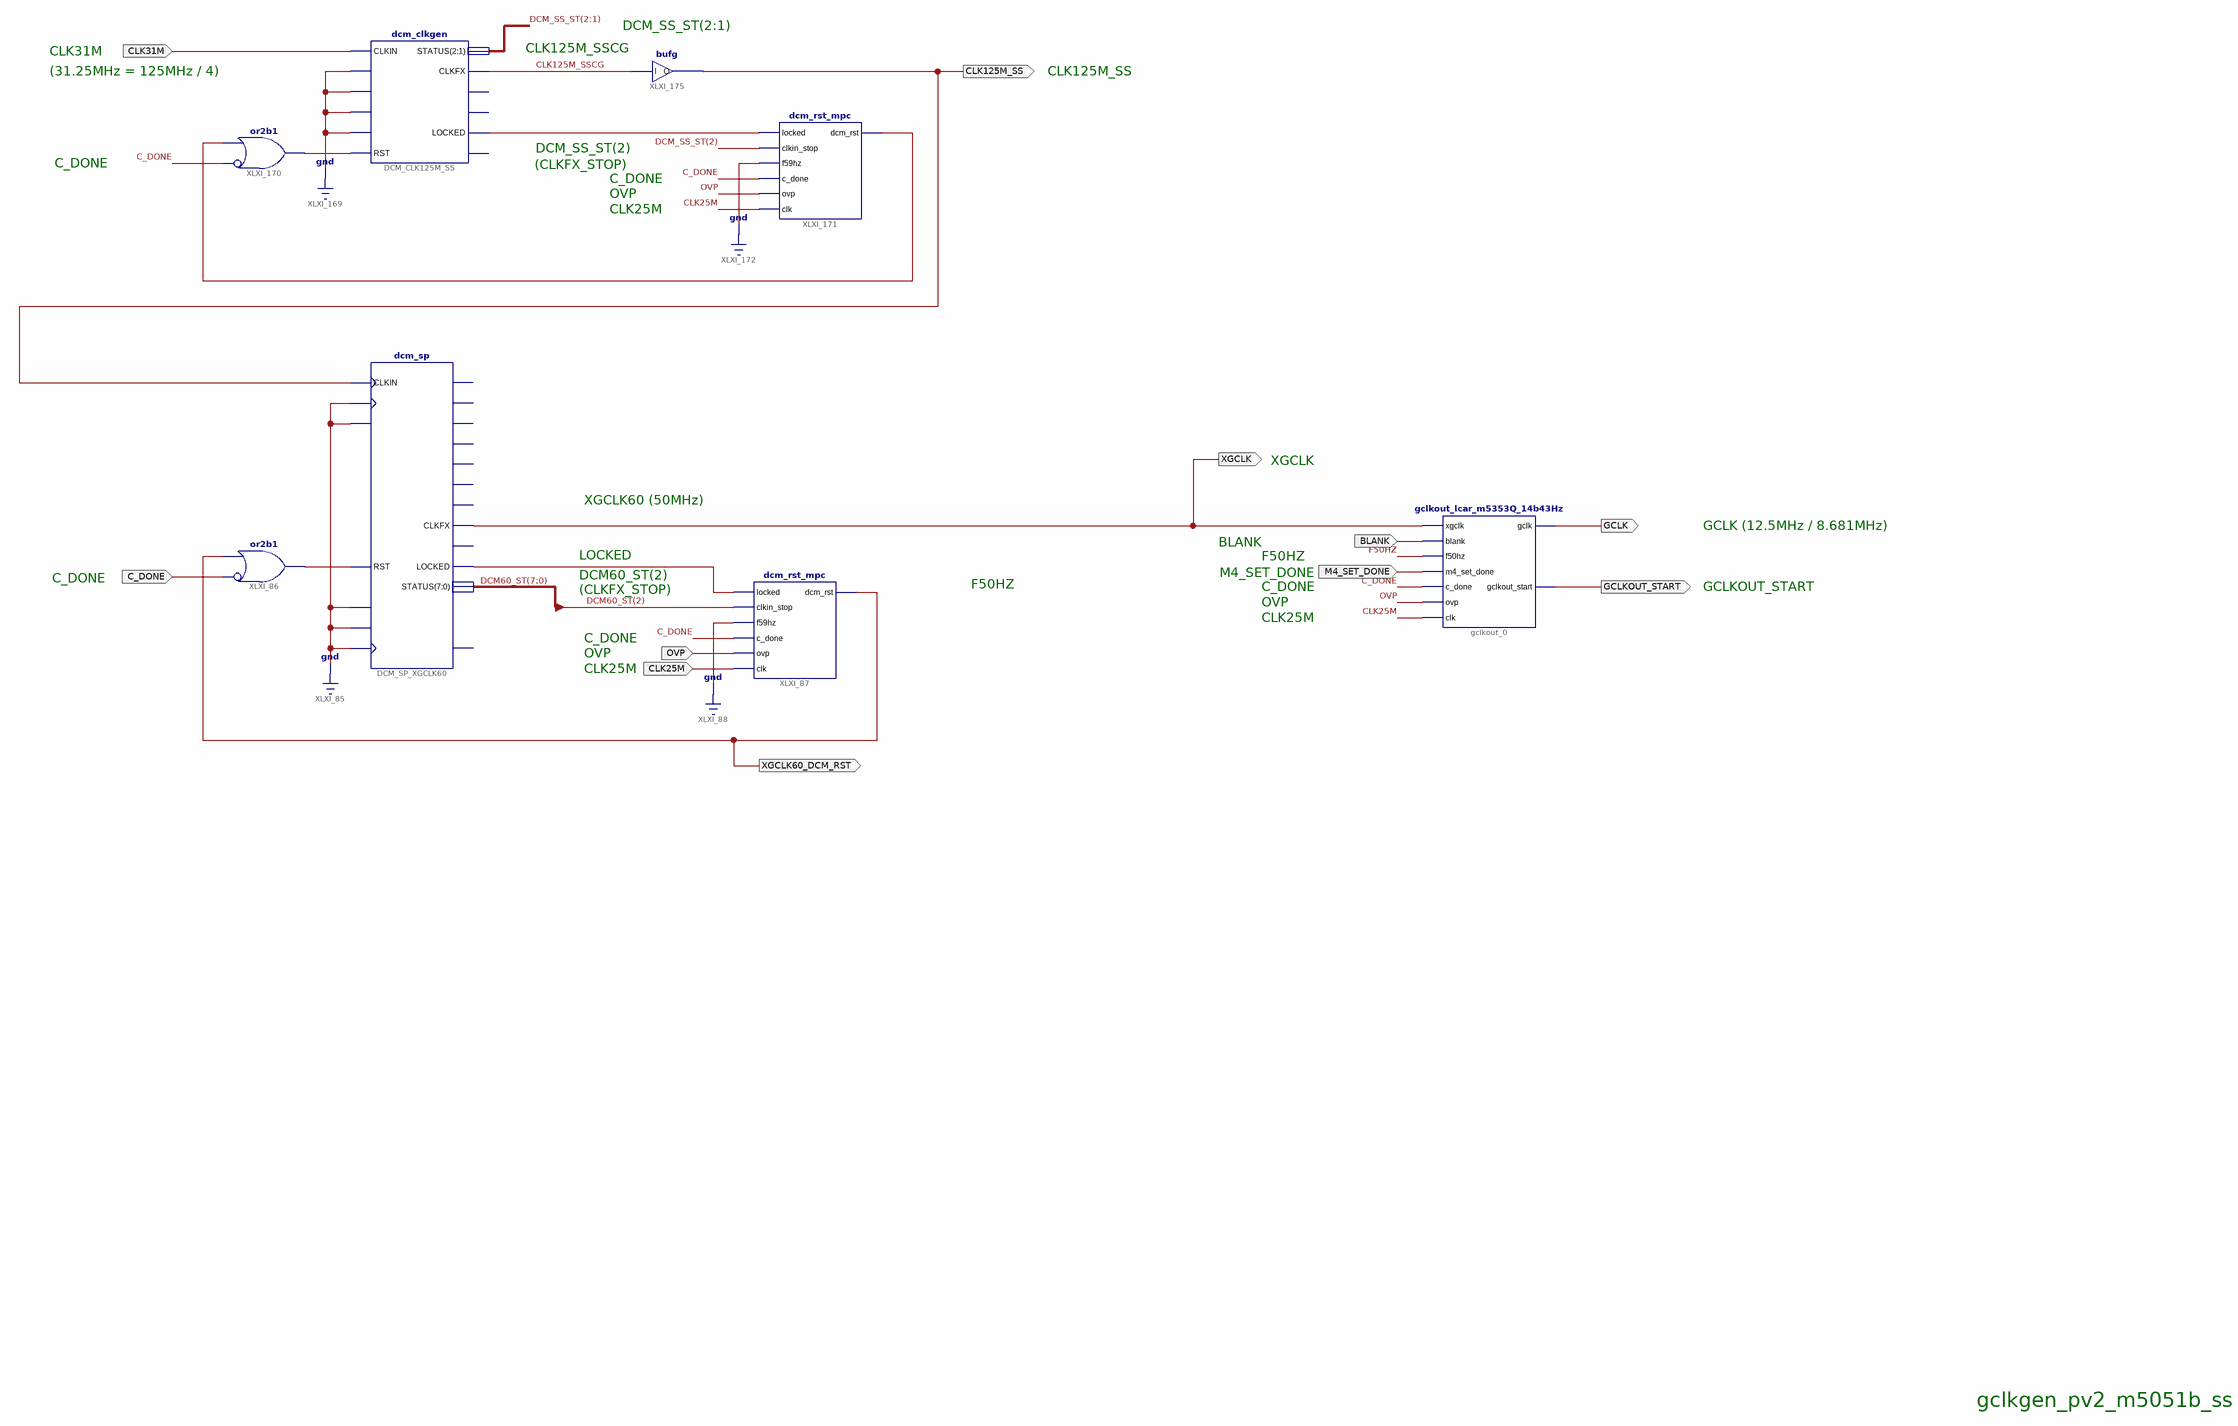
[diagram p0: schematic sheet 1]
// Xilinx ISE schematic gclkgen_lcar_m5353Q_14b43Hz.sch (aspartan6) as structural Verilog: 8 symbols, 11 ports
module gclkgen_lcar_m5353Q_14b43Hz (
  input  C_DONE,
  input  OVP,
  input  CLK25M,
  input  CLK31M,
  input  BLANK,
  input  M4_SET_DONE,
  output XGCLK60_DCM_RST,
  output XGCLK,
  output GCLK,
  output GCLKOUT_START,
  output CLK125M_SS
);

  wire CLK125M_SSCG, F50HZ, XLXN_151, XLXN_159, XLXN_355, XLXN_367, XLXN_368;
  wire [2:1] DCM_SS_ST;
  wire [7:0] DCM60_ST;

  dcm_sp #(.CLKIN_PERIOD(8), .CLK_FEEDBACK("NONE"), .CLKFX_MULTIPLY(4), .CLKFX_DIVIDE(10), .DESKEW_ADJUST("SYSTEM_SYNCHRONOUS")) DCM_SP_XGCLK60 (
    .CLKFB(1'b0), .CLKIN(CLK125M_SS), .DSSEN(1'b0), .PSCLK(1'b0), .PSEN(1'b0), .PSINCDEC(1'b0),
    .RST(XLXN_151), .CLKFX(XGCLK), .LOCKED(XLXN_159), .STATUS(DCM60_ST));  // open: CLK0, CLK180, CLK270, CLK2X, CLK2X180, CLK90, CLKDV, CLKFX180, PSDONE
  or XLXI_86 (XLXN_151, ~C_DONE, XGCLK60_DCM_RST);  // or2b1
  dcm_rst_mpc XLXI_87 (
    .locked(XLXN_159), .dcm_rst(XGCLK60_DCM_RST), .clkin_stop(DCM60_ST[2]), .f59hz(1'b0), .c_done(C_DONE),
    .ovp(OVP), .clk(CLK25M));
  dcm_clkgen #(.SPREAD_SPECTRUM("CENTER_HIGH_SPREAD"), .CLKIN_PERIOD(32.0), .CLKFX_MULTIPLY(8), .CLKFX_MD_MAX(4.000), .CLKFX_DIVIDE(2)) DCM_CLK125M_SS (
    .CLKIN(CLK31M), .FREEZEDCM(1'b0), .PROGCLK(1'b0), .PROGDATA(1'b0), .PROGEN(1'b0), .RST(XLXN_355),
    .STATUS(DCM_SS_ST), .CLKFX(CLK125M_SSCG), .LOCKED(XLXN_367));  // open: CLKFX180, CLKFXDV, PROGDONE
  or XLXI_170 (XLXN_355, ~C_DONE, XLXN_368);  // or2b1
  dcm_rst_mpc XLXI_171 (
    .locked(XLXN_367), .dcm_rst(XLXN_368), .clkin_stop(DCM_SS_ST[2]), .f59hz(1'b0), .c_done(C_DONE),
    .ovp(OVP), .clk(CLK25M));
  bufg XLXI_175 (.I(CLK125M_SSCG), .O(CLK125M_SS));
  gclkout_lcar_m5353Q_14b43Hz gclkout_0 (
    .blank(BLANK), .clk(CLK25M), .c_done(C_DONE), .f50hz(F50HZ), .m4_set_done(M4_SET_DONE), .ovp(OVP),
    .xgclk(XGCLK), .gclk(GCLK), .gclkout_start(GCLKOUT_START));

  // Notes on the sheet:
  //   DCM_SS_ST(2:1)
  //   CLK125M_SSCG
  //   CLK31M
  //   (31.25MHz = 125MHz / 4)
  //   CLK125M_SS
  //   DCM_SS_ST(2)
  //   C_DONE
  //   (CLKFX_STOP)
  //   C_DONE
  //   OVP
  //   CLK25M
  //   XGCLK
  //   XGCLK60 (50MHz)
  //   GCLK (12.5MHz / 8.681MHz)
  //   BLANK
  //   LOCKED
  //   F50HZ
  //   M4_SET_DONE
  //   DCM60_ST(2)
  //   C_DONE
  //   F50HZ
  //   C_DONE
  //   GCLKOUT_START
  //   (CLKFX_STOP)
  //   OVP
  //   CLK25M
  //   C_DONE
  //   OVP
  //   CLK25M
  //   gclkgen_pv2_m5051b_ss
endmodule
